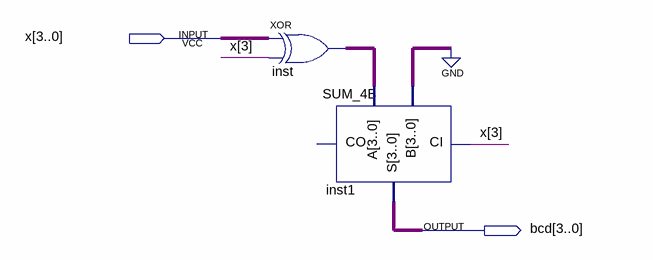
[diagram p0: schematic sheet]
// Quartus schematic CA2_BCD_4B.bdf as structural Verilog: 2 symbols, 2 pins
module CA2_BCD_4B (
  input  [3:0] x,
  output [3:0] bcd
);

  wire [3:0] inst_out;

  assign inst_out = x ^ {4{x[3]}};  // XOR inst, 4 bits wide
  SUM_4B inst1 (.A(inst_out), .B(4'b0000), .CI(x[3]), .S(bcd));  // open: CO
endmodule
